# Altium schematic sheet IMX7S_MEMORY.SchDoc
size A2
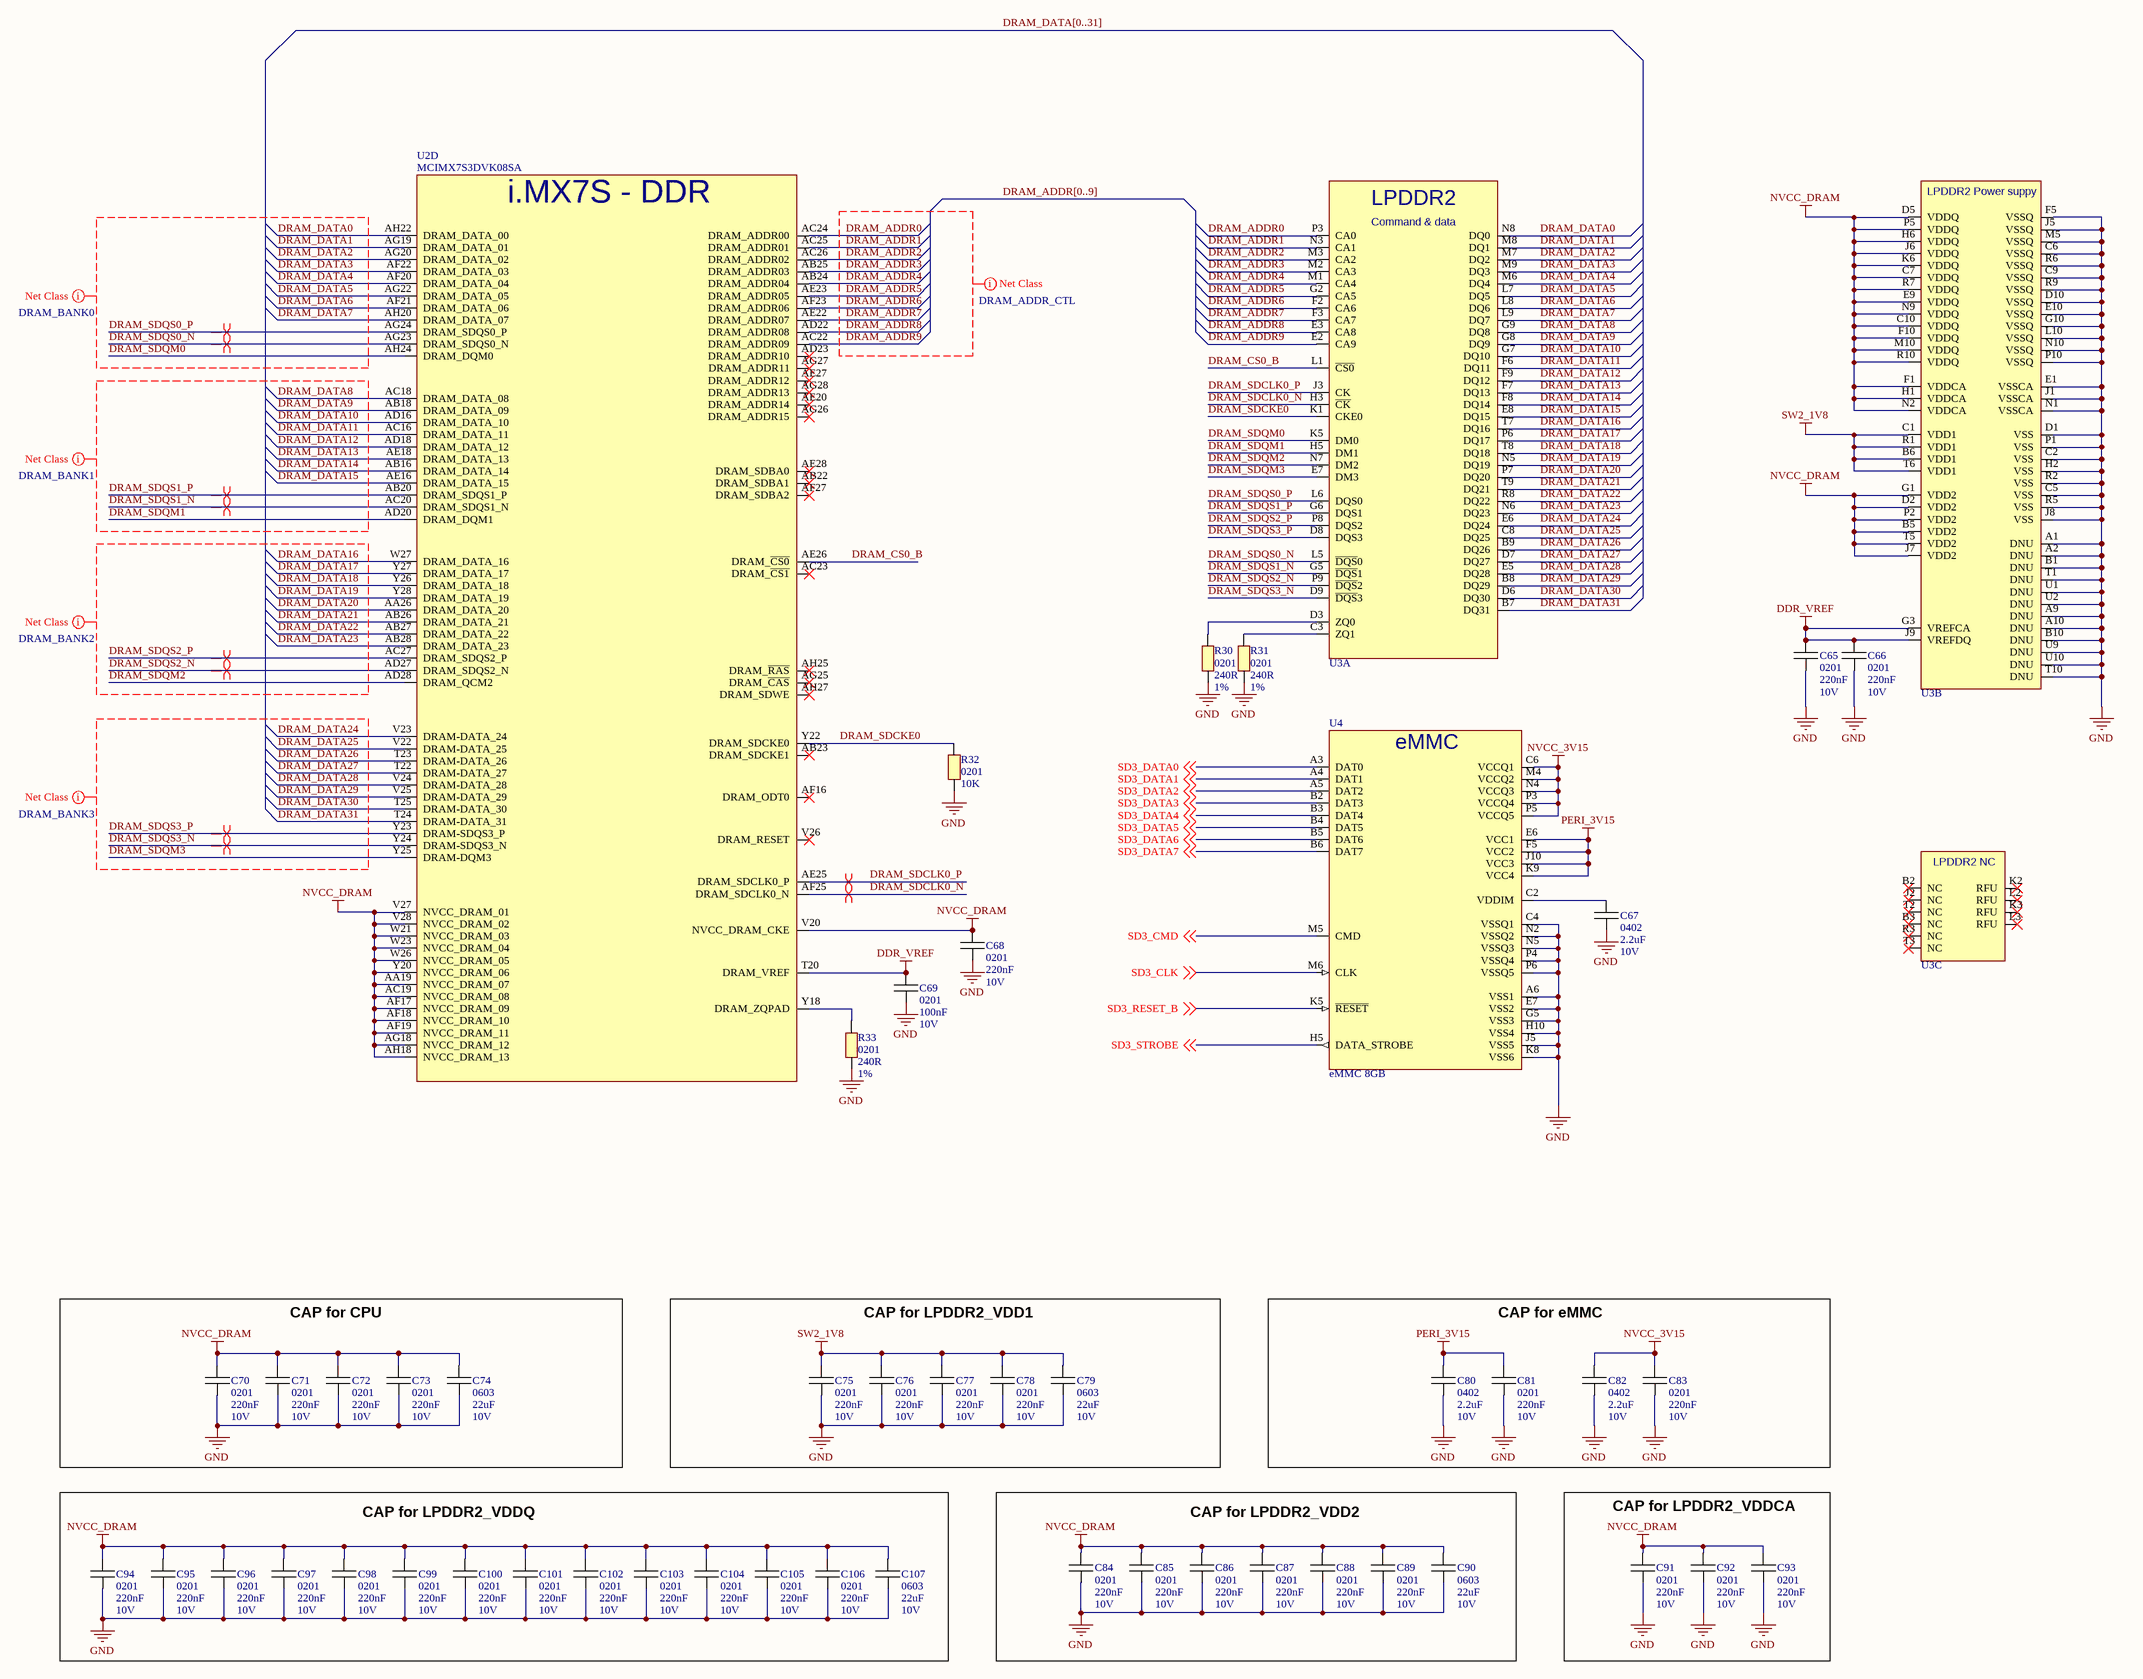
[diagram p0: IMX7S_MEMORY.SchDoc]

## Parts
C65  value 220nF  PACKAGE: 0201  VOLTAGE: 10V  [C0201]  (hidden comment: C0201)
C66  value 220nF  PACKAGE: 0201  VOLTAGE: 10V  [C0201]  (hidden comment: C0201)
C67  value 2.2uF  PACKAGE: 0402  VOLTAGE: 10V  [C0402]  (hidden comment: C0402)
C68  value 220nF  PACKAGE: 0201  VOLTAGE: 10V  [C0201]  (hidden comment: C0201)
C69  value 100nF  PACKAGE: 0201  VOLTAGE: 10V  [C0201]  (hidden comment: C0201)
C70  value 220nF  PACKAGE: 0201  VOLTAGE: 10V  [C0201]  (hidden comment: C0201)
C71  value 220nF  PACKAGE: 0201  VOLTAGE: 10V  [C0201]  (hidden comment: C0201)
C72  value 220nF  PACKAGE: 0201  VOLTAGE: 10V  [C0201]  (hidden comment: C0201)
C73  value 220nF  PACKAGE: 0201  VOLTAGE: 10V  [C0201]  (hidden comment: C0201)
C74  value 22uF  PACKAGE: 0603  VOLTAGE: 10V  [C0603]  (hidden comment: C0603)
C75  value 220nF  PACKAGE: 0201  VOLTAGE: 10V  [C0201]  (hidden comment: C0201)
C76  value 220nF  PACKAGE: 0201  VOLTAGE: 10V  [C0201]  (hidden comment: C0201)
C77  value 220nF  PACKAGE: 0201  VOLTAGE: 10V  [C0201]  (hidden comment: C0201)
C78  value 220nF  PACKAGE: 0201  VOLTAGE: 10V  [C0201]  (hidden comment: C0201)
C79  value 22uF  PACKAGE: 0603  VOLTAGE: 10V  [C0603]  (hidden comment: C0603)
C80  value 2.2uF  PACKAGE: 0402  VOLTAGE: 10V  [C0402]  (hidden comment: C0402)
C81  value 220nF  PACKAGE: 0201  VOLTAGE: 10V  [C0201]  (hidden comment: C0201)
C82  value 2.2uF  PACKAGE: 0402  VOLTAGE: 10V  [C0402]  (hidden comment: C0402)
C83  value 220nF  PACKAGE: 0201  VOLTAGE: 10V  [C0201]  (hidden comment: C0201)
C84  value 220nF  PACKAGE: 0201  VOLTAGE: 10V  [C0201]  (hidden comment: C0201)
C85  value 220nF  PACKAGE: 0201  VOLTAGE: 10V  [C0201]  (hidden comment: C0201)
C86  value 220nF  PACKAGE: 0201  VOLTAGE: 10V  [C0201]  (hidden comment: C0201)
C87  value 220nF  PACKAGE: 0201  VOLTAGE: 10V  [C0201]  (hidden comment: C0201)
C88  value 220nF  PACKAGE: 0201  VOLTAGE: 10V  [C0201]  (hidden comment: C0201)
C89  value 220nF  PACKAGE: 0201  VOLTAGE: 10V  [C0201]  (hidden comment: C0201)
C90  value 22uF  PACKAGE: 0603  VOLTAGE: 10V  [C0603]  (hidden comment: C0603)
C91  value 220nF  PACKAGE: 0201  VOLTAGE: 10V  [C0201]  (hidden comment: C0201)
C92  value 220nF  PACKAGE: 0201  VOLTAGE: 10V  [C0201]  (hidden comment: C0201)
C93  value 220nF  PACKAGE: 0201  VOLTAGE: 10V  [C0201]  (hidden comment: C0201)
C94  value 220nF  PACKAGE: 0201  VOLTAGE: 10V  [C0201]  (hidden comment: C0201)
C95  value 220nF  PACKAGE: 0201  VOLTAGE: 10V  [C0201]  (hidden comment: C0201)
C96  value 220nF  PACKAGE: 0201  VOLTAGE: 10V  [C0201]  (hidden comment: C0201)
C97  value 220nF  PACKAGE: 0201  VOLTAGE: 10V  [C0201]  (hidden comment: C0201)
C98  value 220nF  PACKAGE: 0201  VOLTAGE: 10V  [C0201]  (hidden comment: C0201)
C99  value 220nF  PACKAGE: 0201  VOLTAGE: 10V  [C0201]  (hidden comment: C0201)
C100  value 220nF  PACKAGE: 0201  VOLTAGE: 10V  [C0201]  (hidden comment: C0201)
C101  value 220nF  PACKAGE: 0201  VOLTAGE: 10V  [C0201]  (hidden comment: C0201)
C102  value 220nF  PACKAGE: 0201  VOLTAGE: 10V  [C0201]  (hidden comment: C0201)
C103  value 220nF  PACKAGE: 0201  VOLTAGE: 10V  [C0201]  (hidden comment: C0201)
C104  value 220nF  PACKAGE: 0201  VOLTAGE: 10V  [C0201]  (hidden comment: C0201)
C105  value 220nF  PACKAGE: 0201  VOLTAGE: 10V  [C0201]  (hidden comment: C0201)
C106  value 220nF  PACKAGE: 0201  VOLTAGE: 10V  [C0201]  (hidden comment: C0201)
C107  value 22uF  PACKAGE: 0603  VOLTAGE: 10V  [C0603]  (hidden comment: C0603)
R30  value 240R  PACKAGE: 0201  VOLTAGE: 1%  [R0201]  (hidden comment: R0201)
R31  value 240R  PACKAGE: 0201  VOLTAGE: 1%  [R0201]  (hidden comment: R0201)
R32  value 10K  PACKAGE: 0201  [R0201]  (hidden comment: R0201)
R33  value 240R  PACKAGE: 0201  VOLTAGE: 1%  [R0201]  (hidden comment: R0201)
U2  MCIMX7S3DVK08SA  [BGA 488 PIN]  (part D of 13)
U3  EDB2432B4MA-1DAAT-F-R  [DDR_VFBGA]  (value not drawn)  (parts A,B,C of 3)
U4  eMMC 8GB  [VFBGA]

## Blocks framed on the sheet
CAP for CPU: C70-C74
CAP for LPDDR2_VDD1: C75-C79
CAP for eMMC: C80-C83
CAP for LPDDR2_VDDQ: C94-C107
CAP for LPDDR2_VDD2: C84-C90
CAP for LPDDR2_VDDCA: C91-C93

## Nets
DDR_VREF: C65.2 C66.2 C69.2 U2.T20(DRAM_VREF) U3.G3(VREFCA) U3.J9(VREFDQ)
GND: C65.1 C66.1 C67.1 C68.1 C69.1 C70.1 C71.1 C72.1 C73.1 C74.1 C75.1 C76.1 C77.1 C78.1 C79.1 C80.1 C81.1 C82.1 C83.1 C84.1 C85.1 C86.1 C87.1 C88.1 C89.1 C90.1 C91.1 C92.1 C93.1 C94.1 C95.1 C96.1 C97.1 C98.1 C99.1 C100.1 C101.1 C102.1 C103.1 C104.1 C105.1 C106.1 C107.1 R30.1 R31.1 R32.1 R33.1 U3.A1(DNU) U3.A2(DNU) U3.A9(DNU) U3.A10(DNU) U3.B1(DNU) U3.B10(DNU) U3.C2(VSS) U3.C5(VSS) U3.C6(VSSQ) U3.C9(VSSQ) U3.D1(VSS) U3.D10(VSSQ) U3.E1(VSSCA) U3.E10(VSSQ) U3.F5(VSSQ) U3.G10(VSSQ) U3.H2(VSS) U3.J1(VSSCA) U3.J5(VSSQ) U3.J8(VSS) U3.L10(VSSQ) U3.M5(VSSQ) U3.N1(VSSCA) U3.N10(VSSQ) U3.P1(VSS) U3.P10(VSSQ) U3.R2(VSS) U3.R5(VSS) U3.R6(VSSQ) U3.R9(VSSQ) U3.T1(DNU) U3.T10(DNU) U3.U1(DNU) U3.U2(DNU) U3.U9(DNU) U3.U10(DNU) U4.A6(VSS1) U4.C4(VSSQ1) U4.E7(VSS2) U4.G5(VSS3) U4.H10(VSS4) U4.J5(VSS5) U4.K8(VSS6) U4.N2(VSSQ2) U4.N5(VSSQ3) U4.P4(VSSQ4) U4.P6(VSSQ5)
NVCC_3V15: C82.2 C83.2 U4.C6(VCCQ1) U4.M4(VCCQ2) U4.N4(VCCQ3) U4.P3(VCCQ4) U4.P5(VCCQ5)
NVCC_DRAM: C68.2 C70.2 C71.2 C72.2 C73.2 C74.2 C84.2 C85.2 C86.2 C87.2 C88.2 C89.2 C90.2 C91.2 C92.2 C93.2 C94.2 C95.2 C96.2 C97.2 C98.2 C99.2 C100.2 C101.2 C102.2 C103.2 C104.2 C105.2 C106.2 C107.2 U2.AA19(NVCC_DRAM_07) U2.AC19(NVCC_DRAM_08) U2.AF17(NVCC_DRAM_09) U2.AF18(NVCC_DRAM_10) U2.AF19(NVCC_DRAM_11) U2.AG18(NVCC_DRAM_12) U2.AH18(NVCC_DRAM_13) U2.V20(NVCC_DRAM_CKE) U2.V27(NVCC_DRAM_01) U2.V28(NVCC_DRAM_02) U2.W21(NVCC_DRAM_03) U2.W23(NVCC_DRAM_04) U2.W26(NVCC_DRAM_05) U2.Y20(NVCC_DRAM_06) U3.B5(VDD2) U3.C7(VDDQ) U3.C10(VDDQ) U3.D2(VDD2) U3.D5(VDDQ) U3.E9(VDDQ) U3.F1(VDDCA) U3.F10(VDDQ) U3.G1(VDD2) U3.H1(VDDCA) U3.H6(VDDQ) U3.J6(VDDQ) U3.J7(VDD2) U3.K6(VDDQ) U3.M10(VDDQ) U3.N2(VDDCA) U3.N9(VDDQ) U3.P2(VDD2) U3.P5(VDDQ) U3.R7(VDDQ) U3.R10(VDDQ) U3.T5(VDD2)
PERI_3V15: C80.2 C81.2 U4.E6(VCC1) U4.F5(VCC2) U4.J10(VCC3) U4.K9(VCC4)
SW2_1V8: C75.2 C76.2 C77.2 C78.2 C79.2 U3.B6(VDD1) U3.C1(VDD1) U3.R1(VDD1) U3.T6(VDD1)
DRAM_ADDR0: U2.AC24(DRAM_ADDR00) U3.P3(CA0)
DRAM_ADDR1: U2.AC25(DRAM_ADDR01) U3.N3(CA1)
DRAM_ADDR2: U2.AC26(DRAM_ADDR02) U3.M3(CA2)
DRAM_ADDR3: U2.AB25(DRAM_ADDR03) U3.M2(CA3)
DRAM_ADDR4: U2.AB24(DRAM_ADDR04) U3.M1(CA4)
DRAM_ADDR5: U2.AE23(DRAM_ADDR05) U3.G2(CA5)
DRAM_ADDR6: U2.AF23(DRAM_ADDR06) U3.F2(CA6)
DRAM_ADDR7: U2.AE22(DRAM_ADDR07) U3.F3(CA7)
DRAM_ADDR8: U2.AD22(DRAM_ADDR08) U3.E3(CA8)
DRAM_ADDR9: U2.AC22(DRAM_ADDR09) U3.E2(CA9)
DRAM_CS0_B: U2.AE26(DRAM_~{CS0}) U3.L1(~{CS0})
DRAM_DATA0: U2.AH22(DRAM_DATA_00) U3.N8(DQ0)
DRAM_DATA1: U2.AG19(DRAM_DATA_01) U3.M8(DQ1)
DRAM_DATA2: U2.AG20(DRAM_DATA_02) U3.M7(DQ2)
DRAM_DATA3: U2.AF22(DRAM_DATA_03) U3.M9(DQ3)
DRAM_DATA4: U2.AF20(DRAM_DATA_04) U3.M6(DQ4)
DRAM_DATA5: U2.AG22(DRAM_DATA_05) U3.L7(DQ5)
DRAM_DATA6: U2.AF21(DRAM_DATA_06) U3.L8(DQ6)
DRAM_DATA7: U2.AH20(DRAM_DATA_07) U3.L9(DQ7)
DRAM_DATA8: U2.AC18(DRAM_DATA_08) U3.G9(DQ8)
DRAM_DATA9: U2.AB18(DRAM_DATA_09) U3.G8(DQ9)
DRAM_DATA10: U2.AD16(DRAM_DATA_10) U3.G7(DQ10)
DRAM_DATA11: U2.AC16(DRAM_DATA_11) U3.F6(DQ11)
DRAM_DATA12: U2.AD18(DRAM_DATA_12) U3.F9(DQ12)
DRAM_DATA13: U2.AE18(DRAM_DATA_13) U3.F7(DQ13)
DRAM_DATA14: U2.AB16(DRAM_DATA_14) U3.F8(DQ14)
DRAM_DATA15: U2.AE16(DRAM_DATA_15) U3.E8(DQ15)
DRAM_DATA16: U2.W27(DRAM_DATA_16) U3.T7(DQ16)
DRAM_DATA17: U2.Y27(DRAM_DATA_17) U3.P6(DQ17)
DRAM_DATA18: U2.Y26(DRAM_DATA_18) U3.T8(DQ18)
DRAM_DATA19: U2.Y28(DRAM_DATA_19) U3.N5(DQ19)
DRAM_DATA20: U2.AA26(DRAM_DATA_20) U3.P7(DQ20)
DRAM_DATA21: U2.AB26(DRAM_DATA_21) U3.T9(DQ21)
DRAM_DATA22: U2.AB27(DRAM_DATA_22) U3.R8(DQ22)
DRAM_DATA23: U2.AB28(DRAM_DATA_23) U3.N6(DQ23)
DRAM_DATA24: U2.V23(DRAM-DATA_24) U3.E6(DQ24)
DRAM_DATA25: U2.V22(DRAM-DATA_25) U3.C8(DQ25)
DRAM_DATA26: U2.T23(DRAM-DATA_26) U3.B9(DQ26)
DRAM_DATA27: U2.T22(DRAM-DATA_27) U3.D7(DQ27)
DRAM_DATA28: U2.V24(DRAM-DATA_28) U3.E5(DQ28)
DRAM_DATA29: U2.V25(DRAM-DATA_29) U3.B8(DQ29)
DRAM_DATA30: U2.T25(DRAM-DATA_30) U3.D6(DQ30)
DRAM_DATA31: U2.T24(DRAM-DATA_31) U3.B7(DQ31)
DRAM_SDCKE0: R32.2 U2.Y22(DRAM_SDCKE0) U3.K1(CKE0)
DRAM_SDCLK0_N: U2.AF25(DRAM_SDCLK0_N) U3.H3(~{CK})
DRAM_SDCLK0_P: U2.AE25(DRAM_SDCLK0_P) U3.J3(CK)
DRAM_SDQM0: U2.AH24(DRAM_DQM0) U3.K5(DM0)
DRAM_SDQM1: U2.AD20(DRAM_DQM1) U3.H5(DM1)
DRAM_SDQM2: U2.AD28(DRAM_QCM2) U3.N7(DM2)
DRAM_SDQM3: U2.Y25(DRAM-DQM3) U3.E7(DM3)
DRAM_SDQS0_N: U2.AG23(DRAM_SDQS0_N) U3.L5(~{DQS}0)
DRAM_SDQS0_P: U2.AG24(DRAM_SDQS0_P) U3.L6(DQS0)
DRAM_SDQS1_N: U2.AC20(DRAM_SDQS1_N) U3.G5(~{DQS}1)
DRAM_SDQS1_P: U2.AB20(DRAM_SDQS1_P) U3.G6(DQS1)
DRAM_SDQS2_N: U2.AD27(DRAM_SDQS2_N) U3.P9(~{DQS}2)
DRAM_SDQS2_P: U2.AC27(DRAM_SDQS2_P) U3.P8(DQS2)
DRAM_SDQS3_N: U2.Y24(DRAM-SDQS3_N) U3.D9(~{DQS}3)
DRAM_SDQS3_P: U2.Y23(DRAM-SDQS3_P) U3.D8(DQS3)
SD3_CLK: U4.M6(CLK) ; off-sheet SD3_CLK
SD3_CMD: U4.M5(CMD) ; off-sheet SD3_CMD
SD3_DATA0: U4.A3(DAT0) ; off-sheet SD3_DATA0
SD3_DATA1: U4.A4(DAT1) ; off-sheet SD3_DATA1
SD3_DATA2: U4.A5(DAT2) ; off-sheet SD3_DATA2
SD3_DATA3: U4.B2(DAT3) ; off-sheet SD3_DATA3
SD3_DATA4: U4.B3(DAT4) ; off-sheet SD3_DATA4
SD3_DATA5: U4.B4(DAT5) ; off-sheet SD3_DATA5
SD3_DATA6: U4.B5(DAT6) ; off-sheet SD3_DATA6
SD3_DATA7: U4.B6(DAT7) ; off-sheet SD3_DATA7
SD3_RESET_B: U4.K5(~{RESET}) ; off-sheet SD3_RESET_B
SD3_STROBE: U4.H5(DATA_STROBE) ; off-sheet SD3_STROBE
NetC67_2: C67.2 U4.C2(VDDIM)
NetR30_2: R30.2 U3.D3(ZQ0)
NetR31_2: R31.2 U3.C3(ZQ1)
NetR33_2: R33.2 U2.Y18(DRAM_ZQPAD)

Not connected (* = marked no-connect by the designer): U2 AB22(DRAM_SDBA1)* AB23(DRAM_SDCKE1)* AC23(DRAM_~{CS1})* AD23(DRAM_ADDR10)* AE20(DRAM_ADDR14)* AE27(DRAM_ADDR12)* AE28(DRAM_SDBA0)* AF16(DRAM_ODT0)* AF27(DRAM_SDBA2)* AG25(DRAM_~{CAS})* AG26(DRAM_ADDR15)* AG27(DRAM_ADDR11)* AG28(DRAM_ADDR13)* AH25(DRAM_~{RAS})* AH27(DRAM_SDWE)* V26(DRAM_RESET)*; U3 B2(NC)* B3(NC)* J2(NC)* K2(RFU)* K3(RFU)* L2(RFU)* L3(RFU)* R3(NC)* T2(NC)* T3(NC)*

## Buses and harness runs
bus DRAM_ADDR[0..9]
bus DRAM_DATA[0..31]

## Layout directives
differential pair: DRAM_SDCLK0_N, DRAM_SDCLK0_P, DRAM_SDQS0_N, DRAM_SDQS0_P, DRAM_SDQS1_N, DRAM_SDQS1_P, DRAM_SDQS2_N, DRAM_SDQS2_P, DRAM_SDQS3_N, DRAM_SDQS3_P
net class DRAM_ADDR_CTL: DRAM_ADDR0, DRAM_ADDR1, DRAM_ADDR2, DRAM_ADDR3, DRAM_ADDR4, DRAM_ADDR5, DRAM_ADDR6, DRAM_ADDR7, DRAM_ADDR8, DRAM_ADDR9
net class DRAM_BANK0: DRAM_DATA0, DRAM_DATA1, DRAM_DATA2, DRAM_DATA3, DRAM_DATA4, DRAM_DATA5, DRAM_DATA6, DRAM_DATA7, DRAM_SDQM0, DRAM_SDQS0_N, DRAM_SDQS0_P
net class DRAM_BANK1: DRAM_DATA8, DRAM_DATA9, DRAM_DATA10, DRAM_DATA11, DRAM_DATA12, DRAM_DATA13, DRAM_DATA14, DRAM_DATA15, DRAM_SDQM1, DRAM_SDQS1_N, DRAM_SDQS1_P
net class DRAM_BANK2: DRAM_DATA16, DRAM_DATA17, DRAM_DATA18, DRAM_DATA19, DRAM_DATA20, DRAM_DATA21, DRAM_DATA22, DRAM_DATA23, DRAM_SDQM2, DRAM_SDQS2_N, DRAM_SDQS2_P
net class DRAM_BANK3: DRAM_DATA24, DRAM_DATA25, DRAM_DATA26, DRAM_DATA27, DRAM_DATA28, DRAM_DATA29, DRAM_DATA30, DRAM_DATA31, DRAM_SDQM3, DRAM_SDQS3_N, DRAM_SDQS3_P

## Notes on the sheet
- Title
- Size:
- Date:
- File:
- A2
- Number:
- Time:
- Revision:
- Sheet
- of
- (in symbol EDB2432B4MA-1DAAT-F-R, part A) LPDDR2; Command & data
- (in symbol EDB2432B4MA-1DAAT-F-R, part B) LPDDR2 Power suppy
- (in symbol EDB2432B4MA-1DAAT-F-R, part C) LPDDR2 NC
- (in symbol MCIMX7S3DVK08SD, part D) i.MX7S - DDR
- (in symbol MTFC8GAKAJCN-4M IT) eMMC

## Library data of the parts
C65 C66 C68 C70-C73 C75-C78 C81 C83-C89 C91-C106 = C0201: Manufacturer 1: Murata; Manufacturer Part Number 1: GRM033R61A224KE90D; Tolerance: 10%; Dielectric: X5R; Supplier 1: Farnell; Supplier Part Number 1: 2990687; Stock 1: 4290; Pricing 1: 10=0,04270, 100=0,02370, 500=0,01800, 2500=0,01350, 7500=0,00950, 15000=0,00760, 75000=0,00630 (EUR); RoHS: Yes; Mount: Surface Mount; Case/Package: 0201; Case Code (Metric): 0603; Case Code (Imperial): 0201; Min Operating Temperature: -55°C; Max Operating Temperature: 85°C; Capacitance: 220nF; Voltage Rating (DC): 10V; Packaging: Tape and Reel; Voltage Rating: 10V; Length: 0.024inch; Width: 0.012inch; Thickness: 0.013inch; ComponentLink1URL: http://www.mouser.com/ds/2/281/c02e-2905.pdf?src-supplier=Mouser; ComponentLink1Description: http://www.mouser.com/ds/2/281/c02e-2905.pdf?src-supplier=Mouser; ComponentLink2URL: http://search.murata.co.jp/Ceramy/image/img/A01X/G101/ENG/GRM033R61A224KE90-01.pdf?src-supplier=Digi-Key; ComponentLink2Description: http://search.murata.co.jp/Ceramy/image/img/A01X/G101/ENG/GRM033R61A224KE90-01.pdf?src-supplier=Digi-Key
C67 = C0402: Manufacturer 1: Wurth Electronics; Manufacturer Part Number 1: 885012105013; Tolerance: 20%; Supplier 1: Farnell; Supplier Part Number 1: 2533930; Stock 1: 11802; Pricing 1: 10=0,21600, 100=0,14100, 500=0,10600, 2500=0,09320, 5000=0,07880, 10000=0,07420, 50000=0,06950 (EUR); RoHS: Yes; Mount: Surface Mount; Case/Package: 0402; Case Code (Metric): 1005; Case Code (Imperial): 0402; Min Operating Temperature: -55°C; Max Operating Temperature: 85°C; Packaging: Tape and Reel; Capacitance: 2.2uF; Voltage Rating: 10V; Length: 0.039inch; Width: 0.02inch; Thickness: 0.022inch; ComponentLink1URL: http://www.farnell.com/datasheets/2031748.pdf?src-supplier=Farnell; ComponentLink1Description: http://www.farnell.com/datasheets/2031748.pdf?src-supplier=Farnell; ComponentLink2URL: https://katalog.we-online.de/pbs/datasheet/885012105013.pdf?src-supplier=Digi-Key; ComponentLink2Description: https://katalog.we-online.de/pbs/datasheet/885012105013.pdf?src-supplier=Digi-Key
C69 = C0201: Manufacturer 1: Murata; Manufacturer Part Number 1: GRM033R61A104KE15D; Dielectric: X5R; Tolerance: 10%; Supplier 1: Farnell; Supplier Part Number 1: 2666355; Stock 1: 2430000; Pricing 1: 15000=0,00510, 75000=0,00310 (EUR); RoHS: Yes; Mount: Surface Mount; Case/Package: 0201; Weight: 6E-06oz; Case Code (Metric): 0603; Case Code (Imperial): 0201; Min Operating Temperature: -55°C; Max Operating Temperature: 85°C; Packaging: Tape and Reel; Capacitance: 100nF; Package Quantity: 1; Voltage Rating (DC): 10V; Termination: SMD/SMT; Voltage Rating: 10V; Length: 0.6mm; Height: 0.3mm; Width: 0.012inch; Thickness: 0.013inch; Depth: 0.3mm; Radiation Hardening: No; REACH SVHC: No SVHC; Lead Free: Lead Free; ComponentLink1URL: https://datasheet.ciiva.com/26843/getdatasheetpartid-308656-26843739.pdf?src-supplier=Verical; ComponentLink1Description: https://datasheet.ciiva.com/26843/getdatasheetpartid-308656-26843739.pdf?src-supplier=Verical; ComponentLink2URL: https://datasheet.ciiva.com/5413/product-5413117.pdf?src-supplier=Mouser; ComponentLink2Description: https://datasheet.ciiva.com/5413/product-5413117.pdf?src-supplier=Mouser; ComponentLink3URL: https://datasheet.ciiva.com/6256/partnumbering-e-01-6256406.pdf?src-supplier=Digi-Key; ComponentLink3Description: https://datasheet.ciiva.com/6256/partnumbering-e-01-6256406.pdf?src-supplier=Digi-Key; ComponentLink4URL: https://datasheet.ciiva.com/6256/partnumbering-e-01-6256408.pdf?src-supplier=Digi-Key; ComponentLink4Description: https://datasheet.ciiva.com/6256/partnumbering-e-01-6256408.pdf?src-supplier=Digi-Key; ComponentLink5URL: https://datasheet.ciiva.com/6256/partnumbering-e-01-6256407.pdf?src-supplier=Digi-Key; ComponentLink5Description: https://datasheet.ciiva.com/6256/partnumbering-e-01-6256407.pdf?src-supplier=Digi-Key
C74 C79 C90 C107 = C0603: Manufacturer 1: Murata; Manufacturer Part Number 1: GRM188R61A226ME15D; Description: CAP, MLCC, X5R, 22UF, 10V, 0603; Material: Ceramic; Tolerance: 20%; Dielectric: X5R; Supplier 1: Farnell; Supplier Part Number 1: 2666496; Stock 1: 2740000; Pricing 1: 4000=0,05170 (EUR); RoHS: Yes; Mount: Surface Mount; Case/Package: 0603; Weight: 0.000222oz; Case Code (Metric): 1608; Case Code (Imperial): 0603; Min Operating Temperature: -55°C; Max Operating Temperature: 85°C; Capacitance: 22uF; Voltage Rating: 10V; Packaging: Tape and Reel; Termination: SMD/SMT; Voltage Rating (DC): 10V; Package Quantity: 4000; Length: 1.6mm; Height: 0.8mm; Width: 0.8mm; Thickness: 0.039inch; Depth: 0.8mm; REACH SVHC: No SVHC; Lead Free: Lead Free; ComponentLink1URL: https://datasheet.ciiva.com/46444/1769893-46444975.pdf?src-supplier=Element14; ComponentLink1Description: https://datasheet.ciiva.com/46444/1769893-46444975.pdf?src-supplier=Element14
C80 C82 = C0402: Manufacturer 1: Murata; Manufacturer Part Number 1: GRM155R61A225KE95D; Description: Cap Ceramic 2.2uF 10V X5R 10% SMD 0402 85C Paper T/R; Material: Ceramic; Tolerance: 10%; Dielectric: X5R; Supplier 1: Farnell; Supplier Part Number 1: 2666415; Stock 1: 170000; Pricing 1: 10000=0,01960, 50000=0,01630 (EUR); RoHS: Yes; Mount: Surface Mount; Case/Package: 0402; Weight: 0.000212oz; Case Code (Metric): 1005; Case Code (Imperial): 0402; Min Operating Temperature: -55°C; Max Operating Temperature: 85°C; Capacitance: 2.2uF; Voltage Rating: 10V; Packaging: Tape and Reel; Termination: SMD/SMT; Voltage Rating (DC): 10V; Package Quantity: 10000; Length: 1mm; Height: 0.5mm; Width: 0.5mm; Thickness: 0.022inch; Depth: 0.5mm; REACH SVHC: No SVHC; Lead Free: Lead Free; ComponentLink1URL: http://www.mouser.com/ds/2/281/c02e-2905.pdf?src-supplier=Mouser; ComponentLink1Description: http://www.mouser.com/ds/2/281/c02e-2905.pdf?src-supplier=Mouser; ComponentLink2URL: http://components.arrow.com/part/dataview/0323_04264073?src-supplier=Arrow+Europe; ComponentLink2Description: http://components.arrow.com/part/dataview/0323_04264073?src-supplier=Arrow+Europe; ComponentLink3URL: http://www.farnell.com/datasheets/1872202.pdf?src-supplier=Farnell; ComponentLink3Description: http://www.farnell.com/datasheets/1872202.pdf?src-supplier=Farnell; ComponentLink4URL: http://www.farnell.com/datasheets/2047915.pdf?src-supplier=Farnell; ComponentLink4Description: http://www.farnell.com/datasheets/2047915.pdf?src-supplier=Farnell; ComponentLink5URL: http://www.farnell.com/datasheets/2047915.pdf?src-supplier=Element14; ComponentLink5Description: http://www.farnell.com/datasheets/2047915.pdf?src-supplier=Element14; ComponentLink6URL: http://psearch.en.murata.com/capacitor/product/GRM155R61A225KE95%23.pdf?src-supplier=Avnet; ComponentLink6Description: http://psearch.en.murata.com/capacitor/product/GRM155R61A225KE95%23.pdf?src-supplier=Avnet; ComponentLink7URL: https://search.murata.co.jp/Ceramy/image/img/A01X/G101/ENG/GRM155R61A225KE95-01.pdf?src-supplier=Digi-Key; ComponentLink7Description: https://search.murata.co.jp/Ceramy/image/img/A01X/G101/ENG/GRM155R61A225KE95-01.pdf?src-supplier=Digi-Key; ComponentLink8URL: http://search.murata.co.jp/Ceramy/image/img/A01X/G101/ENG/GRM155R61A225KE95-01.pdf?src-supplier=Digi-Key; ComponentLink8Description: http://search.murata.co.jp/Ceramy/image/img/A01X/G101/ENG/GRM155R61A225KE95-01.pdf?src-supplier=Digi-Key
R30 R31 R33 = R0201: Manufacturer 1: Panasonic; Manufacturer Part Number 1: ERJ-1GNF2400C; Description: PANASONIC ELECTRONIC COMPONENTS         ERJ1GNF2400C             SMD Chip Resistor, Thick Film, 240 ohm, 25 V, 0201 [0603 Metric], 50 mW,  1%, ERJ1G Series; Power Rating: 50mW; Voltage Rating: 25V; Temperature Coefficient: 200ppm/°C; Supplier 1: Farnell; Supplier Part Number 1: 2396864; Stock 1: 75000; Pricing 1: 15000=0,00540, 75000=0,00370 (EUR); RoHS: Yes; Mount: Surface Mount; Case/Package: 0201; Number of Pins: 2; Weight: 6E-06oz; Case Code (Imperial): 0201; Case Code (Metric): 0603; Contact Plating: Tin,Matte; Min Operating Temperature: -55°C; Max Operating Temperature: 125°C; Resistance: 240R; Tolerance: 1%; Packaging: Tape and Reel; Package Quantity: 15000; Composition: Thick Film; Termination: SMD/SMT; Number of Terminations: 2; Military Standard: Not; Max Power Dissipation: 50mW; Voltage Rating (DC): 25V; Length: 0.6mm; Height: 0.01inch; Width: 0.3mm; Depth: 0.3mm; REACH SVHC: No SVHC; Lead Free: Lead Free; ComponentLink1URL: https://datasheet.ciiva.com/16437/aoa0000ce2-16437750.pdf?src-supplier=Future+Electronics; ComponentLink1Description: https://datasheet.ciiva.com/16437/aoa0000ce2-16437750.pdf?src-supplier=Future+Electronics; ComponentLink2URL: https://datasheet.ciiva.com/24128/aoa0000ce2-24128054.pdf?src-supplier=Mouser; ComponentLink2Description: https://datasheet.ciiva.com/24128/aoa0000ce2-24128054.pdf?src-supplier=Mouser; ComponentLink3URL: https://datasheet.ciiva.com/7710/1678782-7710727.pdf?src-supplier=Element14; ComponentLink3Description: https://datasheet.ciiva.com/7710/1678782-7710727.pdf?src-supplier=Element14; ComponentLink4URL: https://datasheet.ciiva.com/46375/1678782-46375838.pdf?src-supplier=Element14; ComponentLink4Description: https://datasheet.ciiva.com/46375/1678782-46375838.pdf?src-supplier=Element14; ComponentLink5URL: https://datasheet.ciiva.com/43467/1678782-43467039.pdf?src-supplier=Farnell; ComponentLink5Description: https://datasheet.ciiva.com/43467/1678782-43467039.pdf?src-supplier=Farnell
R32 = R0201: Manufacturer 1: Panasonic; Manufacturer Part Number 1: ERJ-1GNF1002C; VOLTAGE: 0V; Description: RESISTOR, 0201, 0.05W, 1%, 10K; Max Power Dissipation: 50mW; Resistance: 10kR; Tolerance: 1%; Voltage Rating: 25V; Temperature Coefficient: 200ppm/°C; Supplier 1: Farnell; Supplier Part Number 1: 2396908; Stock 1: 900000; Pricing 1: 15000=0,00420, 75000=0,00410 (EUR); RoHS: Yes; Mount: Surface Mount; Case/Package: 0201; Number of Pins: 2; Case Code (Metric): 0603; Case Code (Imperial): 0201; Contact Plating: Tin,Matte; Min Operating Temperature: -55°C; Max Operating Temperature: 125°C; Packaging: Tape and Reel; Package Quantity: 15000; Power Rating: 50mW; Composition: Thick Film; Number of Terminations: 2; Military Standard: Not; Voltage Rating (DC): 25V; Length: 0.6mm; Height: 0.01inch; Width: 0.012inch; Depth: 0.3mm; Radiation Hardening: No; Lead Free: Lead Free; REACH SVHC: Unknown; ComponentLink1URL: https://datasheet.ciiva.com/16508/aoa0000ce2-16508478.pdf?src-supplier=Future+Electronics; ComponentLink1Description: https://datasheet.ciiva.com/16508/aoa0000ce2-16508478.pdf?src-supplier=Future+Electronics; ComponentLink2URL: https://datasheet.ciiva.com/28514/1678782-28514095.pdf?src-supplier=Element14; ComponentLink2Description: https://datasheet.ciiva.com/28514/1678782-28514095.pdf?src-supplier=Element14; ComponentLink3URL: https://datasheet.ciiva.com/28514/1678782-28514085.pdf?src-supplier=Element14; ComponentLink3Description: https://datasheet.ciiva.com/28514/1678782-28514085.pdf?src-supplier=Element14; ComponentLink4URL: https://datasheet.ciiva.com/43467/1678782-43467078.pdf?src-supplier=Farnell; ComponentLink4Description: https://datasheet.ciiva.com/43467/1678782-43467078.pdf?src-supplier=Farnell
U2 = MCIMX7S3DVK08SD: Supplier 1: Mouser; Supplier Part Number 1: 771-MCIMX7S3DVK08SD
U3 = EDB2432B4MA-1DAAT-F-R: Manufacturer 1: Micron Technology; Supplier 1: Mouser; Supplier Part Number 1: 340-322059; Manufacturer Part Number 1: EDB2432B4MA-1DAAT-F-R; Stock 1: 1269; Pricing 1: 1=14,26000, 10=13,13000, 25=12,86000, 50=12,81000, 100=11,49000, 250=11,14000, 500=10,60000, 1000=10,23000, 2000=9,89000, 10000=10,23000 (USD); RoHS: No
U4 = MTFC8GAKAJCN-4M IT: Manufacturer 1: Micron Technology; Manufacturer Part Number 1: MTFC8GAKAJCN-4MITTR; Supplier 1: Mouser; Supplier Part Number 1: 340-296563-REEL; Stock 1: 4421; Pricing 1: 1=17,08000, 10=15,72000, 25=15,39000, 50=15,34000, 100=13,76000, 250=13,34000, 500=12,69000, 1000=11,13000, 2000=10,32000, 10000=11,13000 (USD); RoHS: No